# EasyEDA Pro project OpenEarable-PCB-main-2.0.epro, schematic OpenEarable - Main v2.7
Board Name: OpenEarable - Main v2.6; Create Date: 2025-05-28; Page Name: OpenEarable v2.7 Main - Schematic; Project Name: OpenEarable - Main v2.7; Schematic Name: OpenEarable - Main v2.7; Update Date: 2025-06-03; Add into BOM: yes; Company: Karlsruhe Institute of Technology; Convert to PCB: yes; Date: 2024-03-01; Draw By: OpenEarable Team; REV: 2.0; Sheet: 1/1
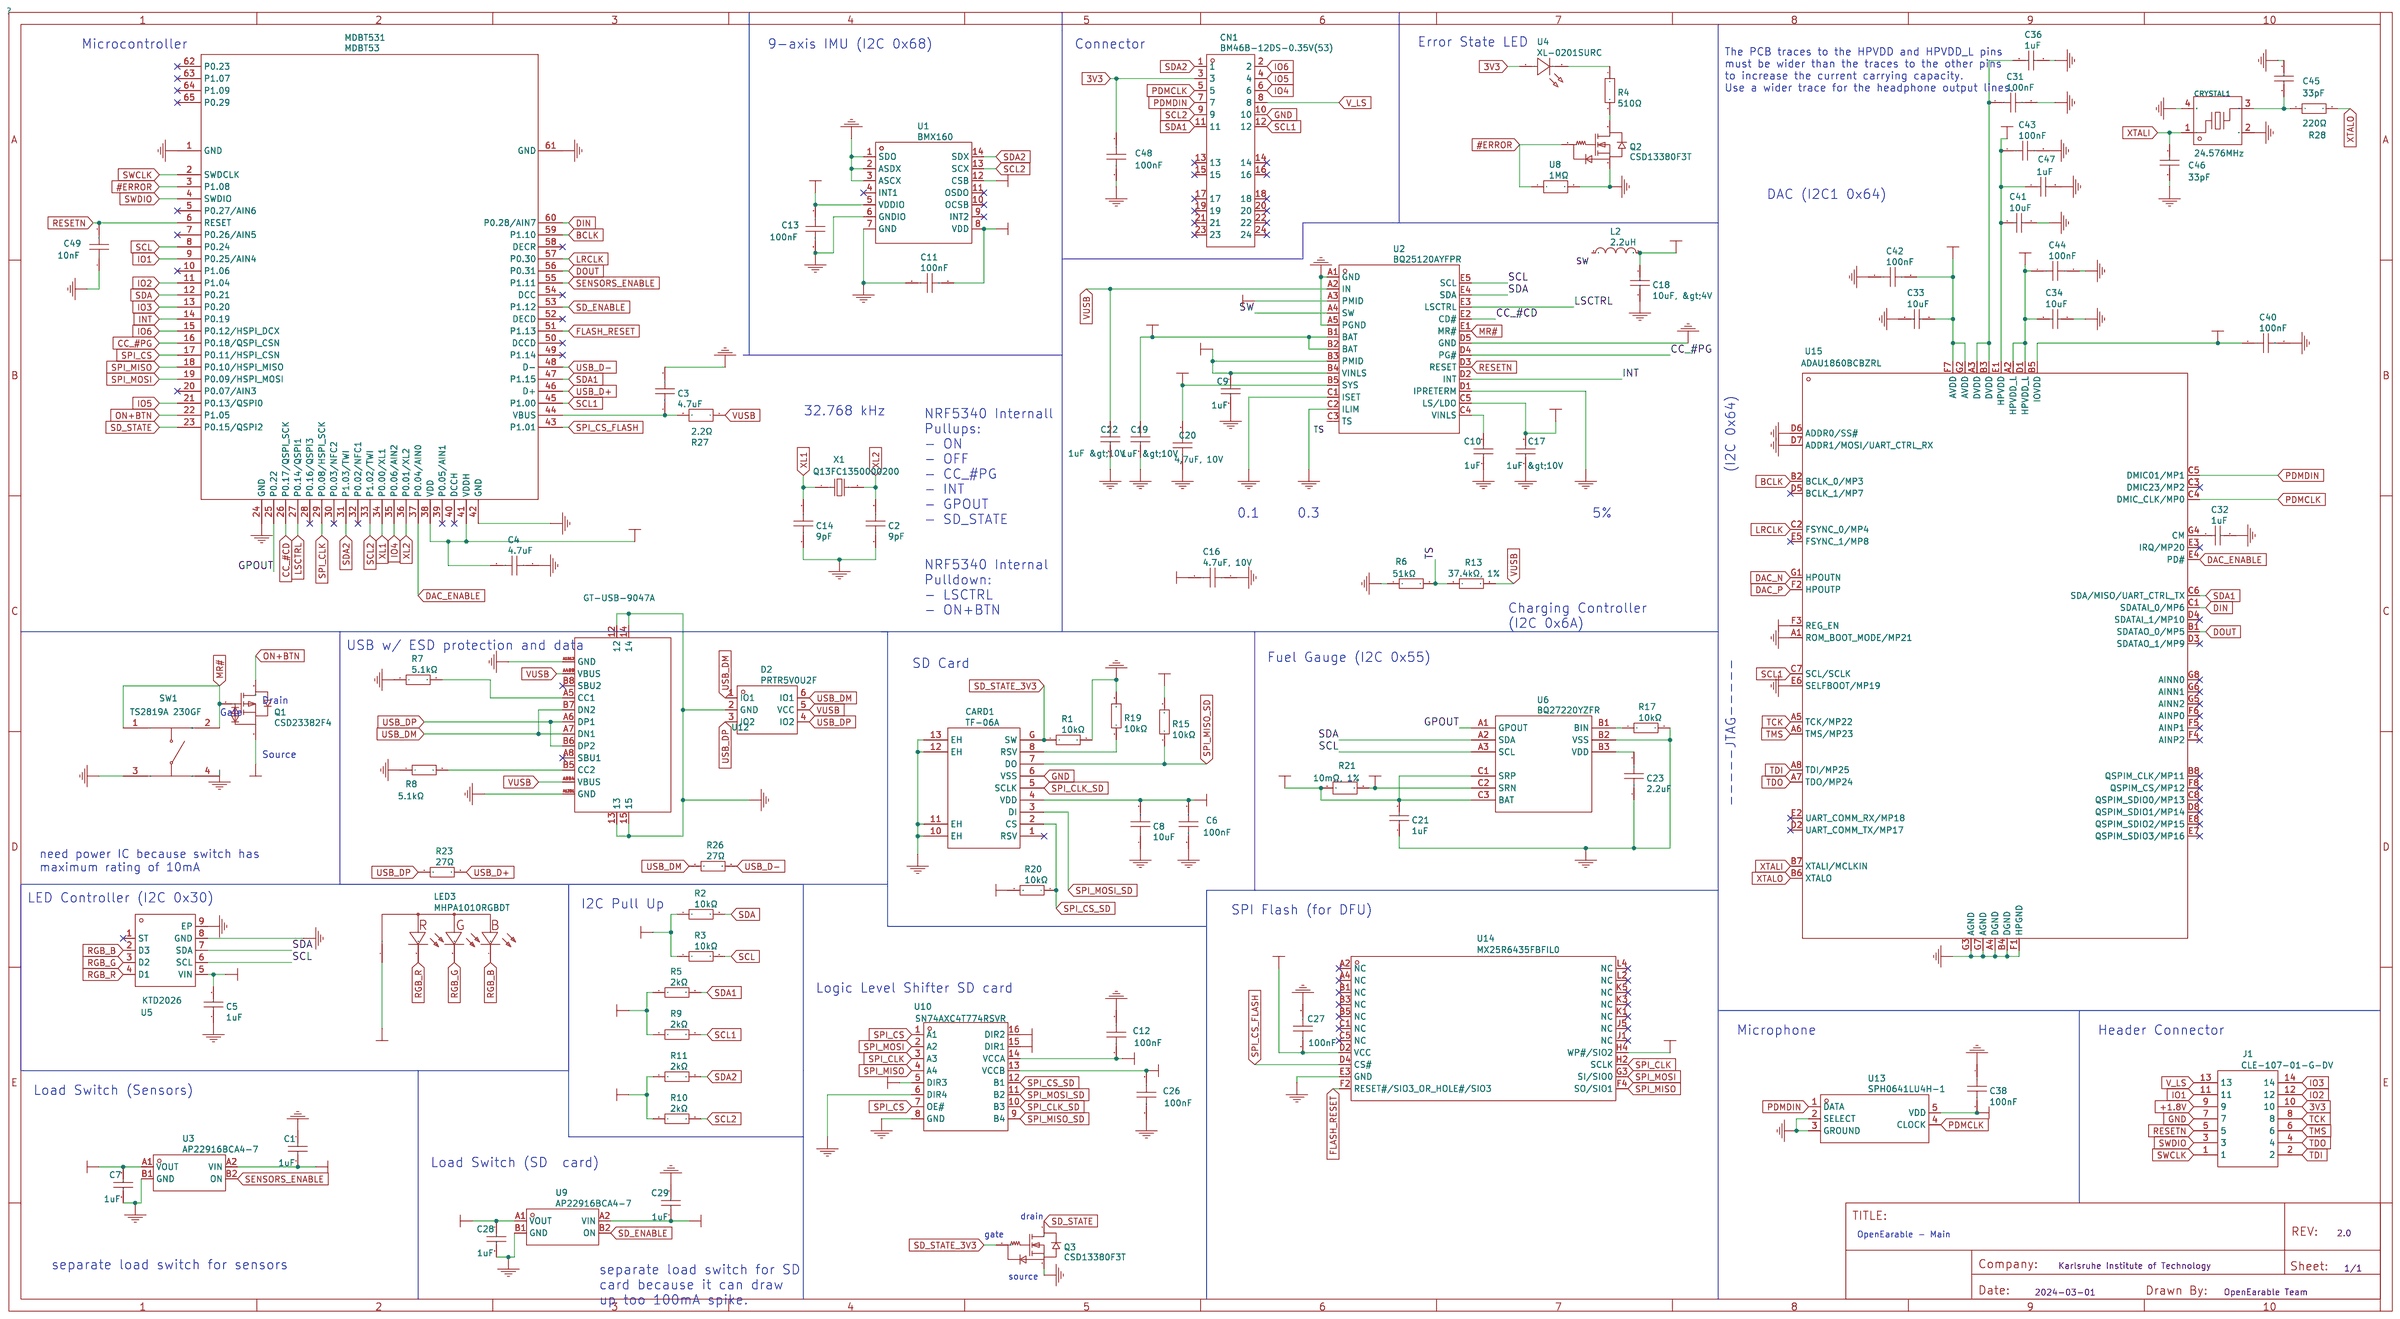
[diagram p0: schematic sheet]

## Parts
C1  1uF  [C0201]
C2  9pF  [C0201]
C3  4.7uF  [C0201]
C4  4.7uF  [C0201]
C5  1uF  [C0201]
C6  100nF  [C0201]
C7  1uF  [C0201]
C8  10uF  [C0402]
C9  1uF  [C0201]
C10  1uF  [C0201]
C11  100nF  [C0201]
C12  100nF  [C0201]
C13  100nF  [C0201]
C14  9pF  [C0201]
C16  4.7uF, 10V  [C0402]
C17  1uF &gt;10V  [C0201]
C18  10uF, &gt;4V  [C0402]
C19  1uF &gt;10V  [C0201]
C20  4.7uF, 10V  [C0402]
C21  1uF  [C0201]
C22  1uF &gt;10V  [C0201]
C23  2.2uF  [C0201]
C26  100nF  [C0201]
C27  100nF  [C0201]
C28  1uF  [C0201]
C29  1uF  [C0201]
C31  100nF  [C0201]
C32  1uF  [C0201]
C33  10uF  [C0402]
C34  10uF  [C0402]
C36  1uF  [C0201]
C38  100nF  [C0201]
C40  100nF  [C0201]
C41  10uF  [C0402]
C42  100nF  [C0201]
C43  100nF  [C0201]
C44  100nF  [C0201]
C45  33pF  [C0201]
C46  33pF  [C0201]
C47  1uF  [C0201]
C48  100nF  [C0201]
C49  10nF  [C0402]
CARD1  TF-06A  [TF-SMD_TF-06A]
CN1  BM46B-12DS-0.35V(53)  [FPC-SMD_12P-P0.35_BM46B-12DS-0.35V]
CRYSTAL1  24.576MHz  [CRYSTAL-SMD_4P-L2.0-W1.6-BL_HUAXIN_CN4]
D2  PRTR5V0U2F  [SON-6_L1.5-W1.0-P0.50-BL]
J1  CLE-107-01-G-DV  [CLE-107-01-X-DV]
L2  2.2uH  [L0402]
LED3  MHPA1010RGBDT  [LED-ARRAY-SMD_4P-L1.0-W1.0-TR-RD]
MDBT531  MDBT53  [MDBT53]
Q1  CSD23382F4  [PICOSTAR-3_L1.0-W0.6-P0.35-TL]
Q2  CSD13380F3T  [PICOSTAR-3_L0.7-W0.6-P0.40-TL]
Q3  CSD13380F3T  [PICOSTAR-3_L0.7-W0.6-P0.40-TL]
R1  10kΩ  [R0201]
R2  10kΩ  [R0201]
R3  10kΩ  [R0201]
R4  510Ω  [R0201]
R5  2kΩ  [R0201]
R6  51kΩ  [R0201]
R7  5.1kΩ  [R0201]
R8  5.1kΩ  [R0201]
R9  2kΩ  [R0201]
R10  2kΩ  [R0201]
R11  2kΩ  [R0201]
R13  37.4kΩ, 1%  [R0402]
R15  10kΩ  [R0201]
R17  10kΩ  [R0201]
R19  10kΩ  [R0201]
R20  10kΩ  [R0201]
R21  10mΩ, 1%  [R0402]
R23  27Ω  [R0201]
R26  27Ω  [R0201]
R27  2.2Ω  [R0201]
R28  220Ω  [R0201]
SW1  TS2819A 230GF  [SW-SMD_4P-L2.8-W1.9-P1.16-LS3.0]
U1  BMX160  [LGA-14_L3.0-W2.5-P0.50-BL]
U2  BQ25120AYFPR  [DSBGA-25_L2.5-W2.6-R5-C5-P0.40-BL]
U3  AP22916BCA4-7  [X1-WLB0808-4_L0.8-W0.8-P0.40-TL]
U4  XL-0201SURC  [LED-SMD_L0.65-W0.35-P0.41_XL-0201SURC]
U5  KTD2026  [DFN-8_L1.5-W1.5-P0.40-BL-EP]
U6  BQ27220YZFR  [DSBGA-9_L1.7-W1.6-R3-C3-P0.50-BL]
U8  1MΩ  [R0201]
U9  AP22916BCA4-7  [X1-WLB0808-4_L0.8-W0.8-P0.40-TL]
U10  SN74AXC4T774RSVR  [UQFN-16_L2.6-W1.8-P0.40-BL]
U12  GT-USB-9047A  [USB-C-SMD_GT-USB-9047A]
U13  SPH0641LU4H-1  [MIC-SMD_5P_L3.5-W2.7-P0.82_SPH0641LU4H-1]
U14  MX25R6435FBFIL0  [WLCSP-22_MX25R6435FBFIL0]
U15  ADAU1860BCBZRL  [BGA-56_L3.0-W2.7-P0.35-R8-C7-TL]
X1  Q13FC1350000200  [FC-135R_L3.2-W1.5]

## Library data of the parts
C1 C5 C7 C9 C10 C21 C28 C29 = 1uF: Supplier: LCSC; Manufacturer Part: GRM033R61A105ME44D; Manufacturer: muRata(村田); Supplier Part: C76935; JLCPCB Part Class: Extended Part
C2 C14 = 9pF: Supplier: LCSC; Supplier Part: C277498; Manufacturer: YAGEO(国巨); Manufacturer Part: CC0201CRNPO9BN9R0; JLCPCB Part Class: Extended Part; link: https://lcsc.com/eda_search?q=C277498&amp;%26type=1&amp;ref=editor
C3 C4 = 4.7uF: Supplier: LCSC; Supplier Part: C335103; Manufacturer: muRata(村田); Manufacturer Part: GRM035R60J475ME15D; JLCPCB Part Class: Extended Part; link: https://lcsc.com/eda_search?q=C335103&amp;%26type=1&amp;ref=editor
C6 C11-C13 C26 C27 = 100nF: Supplier: LCSC; Supplier Part: C2903664; Manufacturer: CCTC(三环); Manufacturer Part: TCC0201X5R104M6R3ZT; JLCPCB Part Class: Extended Part; link: https://lcsc.com/eda_search?q=C2903664&amp;%26type=1&amp;ref=editor
C8 = 10uF: Supplier: LCSC; Supplier Part: C2846677; Manufacturer: FH(风华); Manufacturer Part: 0402X106M100NT; JLCPCB Part Class: Extended Part
C16 C20 = 4.7uF, 10V: Supplier: LCSC; Supplier Part: C368809; Manufacturer: SAMSUNG(三星); Manufacturer Part: CL05A475KP5NRNC; JLCPCB Part Class: Extended Part
C17 C19 C22 = 1uF >10V: Supplier: LCSC; Manufacturer Part: GRM033R61A105ME44D; Manufacturer: muRata(村田); Supplier Part: C76935; JLCPCB Part Class: Extended Part
C18 = 10uF, >4V: Supplier: LCSC; Manufacturer Part: CL05A106MQ5NUNC; Manufacturer: SAMSUNG(三星); Supplier Part: C15525; JLCPCB Part Class: Basic Part
C23 = 2.2uF: Supplier: LCSC; Supplier Part: C285111; Manufacturer: FH(风华); Manufacturer Part: 0201X225M6R3NT; JLCPCB Part Class: Extended Part
C31 C38 C40 C42-C44 C48 = 100nF: Supplier: LCSC; Supplier Part: C76928; Manufacturer: muRata(村田); Manufacturer Part: GRM033R60J104KE19D; JLCPCB Part Class: Extended Part; link: https://lcsc.com/eda_search?q=C2903664&%26type=1&ref=editor
C32 C36 C47 = 1uF: Supplier: LCSC; Manufacturer Part: GRM033R60J105KEA2D; Manufacturer: muRata(村田); Supplier Part: C76929; JLCPCB Part Class: Extended Part
C33 C34 C41 = 10uF: Supplier: LCSC; Manufacturer Part: CL05A106MQ5NUNC; Manufacturer: SAMSUNG(三星); Supplier Part: C15525; JLCPCB Part Class: Basic Part
C45 C46 = GRM0335C1H330JA01D: Capacitance: Tolerance:±5% Tolerance:±5% Voltage Rated: Temperature Coefficient:; LCSC Part Name: 33pF ±5% 50V; Supplier Part: C76925; Manufacturer: muRata(村田); Supplier Footprint: 0201; JLCPCB Part Class: Extended Part; Datasheet: https://atta.szlcsc.com/upload/public/pdf/source/20180307/C76925_15204090911841407715.pdf; Supplier: LCSC; Tolerance: ±5%
C49 = C0402C103J3RACAUTO: Capacitance:10nF Tolerance:±5% Tolerance:±5% Voltage Rating:25V Temperature Coefficient:X7R; LCSC Part Name: 10nF ±5% 25V; Supplier Part: C2180806; Manufacturer: KEMET(基美); Supplier Footprint: 0402; JLCPCB Part Class: Extended Part; Datasheet: https://atta.szlcsc.com/upload/public/pdf/source/20210401/FDDC6E55C3E4F3789C68062DB1227DE4.pdf; Supplier: LCSC; Tolerance: ±5%; Voltage Rating: 25V; Temperature Coefficient: X7R
CARD1 = TF-06A: Supplier: LCSC; Supplier Part: C693844; Manufacturer: 韩国韩荣; JLCPCB Part Class: Extended Part
CN1 = BM46B-12DS-0.35V(51): Supplier: LCSC; Supplier Part: C3646713; Manufacturer: HRS(广濑); JLCPCB Part Class: Extended Part
CRYSTAL1 = CN4024M57620001: Crystal Type:贴片晶振 Frequency: Normal temperature Frequency Tolerance:±10ppm Normal temperature Frequency Tolerance:±10ppm External load capacitor:20pF Frequency Stability(Full temperature range):±30ppm Frequency Stability(Full temperature range):±30ppm Equ; LCSC Part Name: 24.576MHz ±10ppm 20pF; Supplier Part: C7294677; Manufacturer: HUAXIN(华昕); Supplier Footprint: SMD-2016-4P; JLCPCB Part Class: Extended Part; Datasheet: https://atta.szlcsc.com/upload/public/pdf/source/20230629/60BB1F001F1BE929A0AB11A98926D18A.pdf; Supplier: LCSC; Crystal Type: 贴片晶振; Normal temperature Frequency Tolerance: ±10ppm; External load capacitor: 20pF; Frequency Stability(Full temperature range): ±30ppm; Equivalent Series Resistance (ESR): 60Ω
D2 = PRTR5V0U2F: Supplier: LCSC; Supplier Part: C2937001; Manufacturer: TECH PUBLIC(台舟); JLCPCB Part Class: Extended Part
J1 = CLE-107-01-G-DV
L2 = 2.2uH: Supplier: LCSC; Supplier Part: C383389; Manufacturer: TDK; Manufacturer Part: MLZ1005M2R2WT000; JLCPCB Part Class: Extended Part
LED3 = MHPA1010RGBDT: Supplier: LCSC; Supplier Part: C404280; Manufacturer: MEIHUA(美华); JLCPCB Part Class: Extended Part
MDBT531 = MDBT53
Q1 = CSD23382F4: Supplier: LCSC; Supplier Part: C2861620; Manufacturer: TI(德州仪器); JLCPCB Part Class: Extended Part
Q2 Q3 = CSD13380F3T: Supplier: LCSC; Supplier Part: C2871092; Manufacturer: TI(德州仪器); JLCPCB Part Class: Extended Part
R1-R3 R15 R17 R19 R20 = 10kΩ: Supplier: LCSC; Manufacturer: YAGEO(国巨); Manufacturer Part: RC0201FR-0710KL; Supplier Part: C106225; JLCPCB Part Class: Extended Part
R4 = 510Ω: Supplier: LCSC; Supplier Part: C180335; Manufacturer: Walsin(华新科); Manufacturer Part: WR02X511JAL; JLCPCB Part Class: Extended Part
R5 R9-R11 = 2kΩ: Supplier: LCSC; Supplier Part: C100158; Manufacturer: LIZ(丽智电子); Manufacturer Part: CR0201JH0202G; JLCPCB Part Class: Extended Part
R6 = 51kΩ: Supplier: LCSC; Supplier Part: C320938; Manufacturer: FH(风华); Manufacturer Part: RC-01W5102FT; JLCPCB Part Class: Extended Part
R7 R8 = 5.1kΩ: Supplier: LCSC; Supplier Part: C274341; Manufacturer: YAGEO(国巨); Manufacturer Part: RC0201FR-075K1L; JLCPCB Part Class: Extended Part
R13 = 37.4kΩ, 1%: Supplier: LCSC; Supplier Part: C185422; Manufacturer: YAGEO(国巨); Manufacturer Part: RC0402FR-0737K4L; JLCPCB Part Class: Extended Part
R21 = 10mΩ, 1%: Supplier: LCSC; Supplier Part: C346478; Manufacturer: SEI(Stackpole Electronics Inc.); Manufacturer Part: CSRF0402FT10L0; JLCPCB Part Class: Extended Part
R23 R26 = 27Ω: Supplier: LCSC; Supplier Part: C273268; Manufacturer: YAGEO(国巨); Manufacturer Part: RC0201FR-0727RL; JLCPCB Part Class: Extended Part
R27 = 2.2Ω: Supplier: LCSC; Supplier Part: C473517; Manufacturer: UNI-ROYAL(厚声); Manufacturer Part: 0201WMF220KTEE; JLCPCB Part Class: Extended Part
R28 = RC0201FR-07220RL: Type:Thick Film Resistors Resistance: Tolerance:±1% Tolerance:±1% Power(Watts): Overload Voltage (Max): Temperature Coefficient:±200ppm/℃ Temperature Coefficient:±200ppm/℃ Operating Temperature Range:-55℃~+125℃ Operating Temperature Range:-55℃~+125℃; LCSC Part Name: 厚膜电阻 220Ω ±1% 50mW; Supplier Part: C274342; Manufacturer: YAGEO(国巨); Supplier Footprint: 0201; JLCPCB Part Class: Extended Part; Datasheet: https://atta.szlcsc.com/upload/public/pdf/source/20180821/C275644_0D56F95EFF785E7D9A1FEF436B37DA78.pdf; Supplier: LCSC; Type: Thick Film Resistors; Tolerance: ±1%; Temperature Coefficient: ±200ppm/℃; Operating Temperature Range: -55℃~+125℃
SW1 = TS2819A 230GF: Supplier: LCSC; Supplier Part: C388293; Manufacturer: SHOU HAN(首韩); Manufacturer Part: TS2819A 230gf; JLCPCB Part Class: Extended Part
U1 = BMX160: Supplier Part: 828-1087-1-ND; Supplier: Digi-Key; Manufacturer: Bosch; Manufacturer Part: BMI160
U2 = BQ25120AYFPR: Supplier: LCSC; Supplier Part: C2866577; Manufacturer: TI(德州仪器); JLCPCB Part Class: Extended Part; link: https://lcsc.com/eda_search?q=C2866577&amp;%26type=1&amp;ref=editor
U3 U9 = AP22916BCA4-7: Supplier: LCSC; Supplier Part: C5244375; Manufacturer: DIODES(美台); JLCPCB Part Class: Extended Part
U4 = XL-0201SURC: Supplier: LCSC; Supplier Part: C3646923; Manufacturer: XINGLIGHT(成兴光); JLCPCB Part Class: Extended Part
U5 = KTD2026: Supplier: LCSC; Supplier Part: C500368; Manufacturer: KINETIC(芯凯); Manufacturer Part: KTD2026EWE-TR; JLCPCB Part Class: Extended Part
U6 = BQ27220YZFR: Supplier: LCSC; Supplier Part: C528617; Manufacturer: TI(德州仪器); JLCPCB Part Class: Extended Part; link: https://lcsc.com/eda_search?q=C528617&amp;%26type=1&amp;ref=editor
U8 = 1MΩ: Supplier: LCSC; Supplier Part: C5151554; Manufacturer: UNI-ROYAL(厚声); Manufacturer Part: CQ01WMJ0105TEE; JLCPCB Part Class: Extended Part
U10 = SN74AXC4T774RSVR: Supplier: LCSC; Supplier Part: C1849454; Manufacturer: TI(德州仪器); JLCPCB Part Class: Extended Part
U12 = GT-USB-9047A: Supplier: LCSC; Supplier Part: C5117882; Manufacturer: G-Switch(品赞); JLCPCB Part Class: Extended Part
U13 = SPH0641LU4H-1: Supplier: LCSC; Supplier Part: C2879853; Manufacturer: Knowles(楼氏); JLCPCB Part Class: Extended Part
U14 = MX25R6435FBFIL0: Supplier: LCSC; Supplier Part: C6330263; Manufacturer: MXIC(旺宏电子); JLCPCB Part Class: Extended Part
U15 = ADAU1860BCBZRL: Supplier: LCSC; Supplier Part: C17592940; Manufacturer: ADI(亚德诺); JLCPCB Part Class: Extended Part
X1 = Q13FC1350000200: Supplier: LCSC; Manufacturer: EPSON(爱普生); Supplier Part: C48615; JLCPCB Part Class: Extended Part

## Nets
3V3: C5.2 C17.1 C29.2 C48.1 CN1.3 J1.10 LED3.1(+) U2.C5(LS/LDO) U4.1(A) U5.5(VIN) U9.A2(VIN)
+1.8V: C1.2 C4.2 C18.1 C20.2 J1.9 L2.2 MDBT531.38(VDD) MDBT531.41(VDDH) Q1.2(S) R2.1 R3.1 U2.B5(SYS) U3.A2(VIN)
GND: C1.1 C2.1 C3.2 C4.1 C5.1 C6.2 C7.2 C8.1 C9.2 C10.2 C11.1 C12.1 C13.2 C14.1 C16.1 C17.2 C18.2 C19.2 C20.1 C21.1 C22.2 C23.1 C26.2 C27.1 C28.2 C29.1 C31.2 C32.2 C33.1 C34.2 C36.2 C38.1 C40.2 C41.2 C42.1 C43.2 C44.2 C45.2 C46.1 C47.2 C48.2 C49.1 CARD1.6(VSS) CARD1.10(EH) CARD1.11(EH) CARD1.12(EH) CARD1.13(EH) CN1.10 CRYSTAL1.2(GND) CRYSTAL1.4(GND) D2.2(GND) J1.7 MDBT531.1(GND) MDBT531.24(GND) MDBT531.42(GND) MDBT531.61(GND) Q2.2(S) Q3.2(S) R1.2 R6.1 R7.1 R8.1 R17.2 R19.2 SW1.3(B) SW1.4(B&apos;) U1.1(SDO) U1.2(ASDX) U1.3(ASCX) U1.6(GNDIO) U1.7(GND) U2.A1(GND) U2.A5(PGND) U2.C1(ISET) U2.C2(ILIM) U2.D1(IPRETERM) U2.D5(GND) U3.B1(GND) U5.8(GND) U5.9(EP) U6.B2(VSS) U8.2 U9.B1(GND) U10.6(DIR4) U10.8(GND) U12.12 U12.13 U12.14 U12.15 U12.A1B12(GND) U12.A12B1(GND) U13.2(SELECT) U13.3(GROUND) U14.E3(GND) U15.A1(ROM_BOOT_MODE/MP21) U15.A4(DGND) U15.B4(DGND) U15.D6(ADDR0/SS#) U15.D7(ADDR1/MOSI/UART_CTRL_RX) U15.E6(SELFBOOT/MP19) U15.F1(HPGND) U15.G3(AGND) U15.G7(AGND)
VCC: C19.1 R21.2 U2.B1(BAT) U2.B2(BAT) U6.C2(SRN)
#ERROR: MDBT531.3(P1.08) Q2.1(G) U8.1
BCLK: MDBT531.59(P1.10) U15.B2(BCLK_0/MP3)
CC_#CD: MDBT531.26(P0.17/QSPI_SCK) U2.E2(CD#)
CC_#PG: MDBT531.16(P0.18/QSPI_CSN) U2.D4(PG#)
DAC_ENABLE: MDBT531.37(P0.04/AIN0) U15.E4(PD#)
DAC_N: U15.G1(HPOUTN)
DAC_P: U15.F2(HPOUTP)
DIN: MDBT531.60(P0.28/AIN7) U15.C1(SDATAI_0/MP6)
DOUT: MDBT531.56(P0.31) U15.B1(SDATAO_0/MP5)
FLASH_RESET: MDBT531.51(P1.13) U14.F2(RESET#/SIO3 OR HOLE#/SIO3)
GPOUT: MDBT531.25(P0.22) U6.A1(GPOUT)
INT: MDBT531.14(P0.19) U2.D2(INT)
IO1: J1.11 MDBT531.9(P0.25/AIN4)
IO2: J1.12 MDBT531.11(P1.04)
IO3: J1.14 MDBT531.13(P0.20)
IO4: CN1.6 MDBT531.35(P0.06/AIN2)
IO5: CN1.4 MDBT531.21(P0.13/QSPI0)
IO6: CN1.2 MDBT531.15(P0.12/HSPI_DCX)
LRCLK: MDBT531.57(P0.30) U15.C2(FSYNC_0/MP4)
LSCTRL: MDBT531.27(P0.14/QSPI1) U2.E3(LSCTRL)
MR#: Q1.1(G) SW1.1(A) SW1.2(A&apos;) U2.E1(MR#)
ON+BTN: MDBT531.22(P1.05) Q1.3(D)
PDMCLK: CN1.5 U13.4(CLOCK) U15.C4(DMIC_CLK/MP0)
PDMDIN: CN1.7 U13.1(DATA) U15.C5(DMIC01/MP1)
RESETN: C49.2 J1.5 MDBT531.6(RESET) U2.D3(RESET)
RGB_B: LED3.4(B-) U5.2(D3)
RGB_G: LED3.3(G-) U5.3(D2)
RGB_R: LED3.2(R-) U5.4(D1)
SCL: MDBT531.8(P0.24) R3.2 U2.E5(SCL) U5.6(SCL) U6.A3(SCL)
SCL1: CN1.12 MDBT531.45(P1.00) R9.2 U15.C7(SCL/SCLK)
SCL2: CN1.9 MDBT531.33(P1.02/TWI) R10.2 U1.13(SCX)
SD_ENABLE: MDBT531.53(P1.12) U9.B2(ON)
SD_STATE: MDBT531.23(P0.15/QSPI2) Q3.3(D)
SD_STATE_3V3: CARD1.G(SW) Q3.1(G) R1.1
SDA: MDBT531.12(P0.21) R2.2 U2.E4(SDA) U5.7(SDA) U6.A2(SDA)
SDA1: CN1.11 MDBT531.47(P1.15) R5.2 U15.C6(SDA/MISO/UART_CTRL_TX)
SDA2: CN1.1 MDBT531.31(P1.03/TWI) R11.2 U1.14(SDX)
SENSORS_ENABLE: MDBT531.55(P1.11) U3.B2(ON)
SPI_CLK: MDBT531.29(P0.08/HSPI_SCK) U10.3(A3) U14.H2(SCLK)
SPI_CLK_SD: CARD1.5(SCLK) U10.10(B3)
SPI_CS: MDBT531.17(P0.11/HSPI_CSN) U10.1(A1) U10.7(OE#)
SPI_CS_FLASH: MDBT531.43(P1.01) U14.D4(CS#)
SPI_CS_SD: CARD1.2(CS) R20.1 U10.12(B1)
SPI_MISO: MDBT531.18(P0.10/HSPI_MISO) U10.4(A4) U14.F4(SO/SIO1)
SPI_MISO_SD: CARD1.7(DO) R15.1 U10.9(B4)
SPI_MOSI: MDBT531.19(P0.09/HSPI_MOSI) U10.2(A2) U14.G3(SI/SIO0)
SPI_MOSI_SD: CARD1.3(DI) U10.11(B2)
SW: L2.1 U2.A4(SW)
SWCLK: J1.1 MDBT531.2(SWDCLK)
SWDIO: J1.3 MDBT531.4(SWDIO)
TCK: J1.8 U15.A5(TCK/MP22)
TDI: J1.2 U15.A8(TDI/MP25)
TDO: J1.4 U15.A7(TDO/MP24)
TMS: J1.6 U15.A6(TMS/MP23)
TS: R6.2 R13.1 U2.C3(TS)
USB_D+: MDBT531.46(D+) R23.2
USB_D-: MDBT531.48(D-) R26.2
USB_DM: D2.1(IO1) D2.6(IO1) R26.1 U12.A7(DN1) U12.B7(DN2)
USB_DP: D2.3(IO2) D2.4(IO2) R23.1 U12.A6(DP1) U12.B6(DP2)
V_BAT: C21.2 R21.1 U6.C1(SRP) U6.C3(BAT)
V_LS: C7.1 C11.2 C12.2 C13.1 C27.2 C33.2 C34.1 C38.2 C40.1 C41.1 C42.2 C43.1 C44.1 C47.1 CN1.8 J1.13 R5.1 R9.1 R10.1 R11.1 U1.5(VDDIO) U1.8(VDD) U1.12(CSB) U3.A1(VOUT) U10.5(DIR3) U10.14(VCCA) U10.15(DIR1) U10.16(DIR2) U13.5(VDD) U14.D2(VCC) U14.H4(WP#/SIO2) U15.A2(HPVDD_L) U15.B5(IOVDD) U15.D1(HPVDD_L) U15.E1(HPVDD) U15.F3(REG_EN) U15.F7(AVDD) U15.G2(AVDD)
V_PMID: C9.1 C16.2 U2.A3(PMID) U2.B3(PMID) U2.B4(VINLS)
V_SD: C6.1 C8.2 C26.1 C28.1 CARD1.4(VDD) R15.2 R20.2 U9.A1(VOUT) U10.13(VCCB)
VUSB: C22.1 D2.5(VCC) R13.2 R27.1 U2.A2(IN) U12.A4B9(VBUS) U12.A9B4(VBUS)
XL1: C14.2 MDBT531.34(P0.00/XL1) X1.1
XL2: C2.2 MDBT531.36(P0.01/XL2) X1.2
XTALI: C46.2 CRYSTAL1.1 U15.B7(XTALI/MCLKIN)
XTALO: R28.2 U15.B6(XTALO)
$1N36: CARD1.8(RSV) R19.1
$1N48: R7.2 U12.A5(CC1)
$1N49: R8.2 U12.B5(CC2)
$1N65: C10.1 U2.C4(VINLS)
$1N70: C23.2 U6.B3(VDD)
$1N74: R17.1 U6.B1(BIN)
$1N98: C3.1 MDBT531.44(VBUS) R27.2
$1N117: Q2.3(D) R4.2
$1N119: R4.1 U4.2(K)
$1N151: C31.1 C36.1 U15.A3(DVDD) U15.B3(DVDD)
$1N2586: C32.1 U15.G4(CM)
$1N16368: C45.1 CRYSTAL1.3 R28.1

Not connected (* = marked no-connect by the designer): CARD1 1(RSV)*; CN1 13* 14* 15* 16* 17* 18* 19* 20* 21* 22* 23* 24*; MDBT531 5(P0.27/AIN6)* 7(P0.26/AIN5)* 10(P1.06)* 20(P0.07/AIN3)* 28(P0.16/QSPI3)* 30(P0.03/NFC2)* 32(P0.02/NFC1)* 39(P0.05/AIN1)* 40(DCCH)* 49(P1.14)* 50(DCCD)* 52(DECD)* 54(DCC)* 58(DECR)* 62(P0.23)* 63(P1.07)* 64(P1.09)* 65(P0.29)*; U1 4(INT1)* 9(INT2)* 10(OCSB)* 11(OSDO)*; U5 1(ST)*; U12 A8(SBU1)* B8(SBU2)*; U14 A2(NC)* A4(NC)* B1(NC)* B3(NC)* B5(NC)* C1(NC)* C5(NC)* J1(NC)* J5(NC)* K1(NC)* K3(NC)* K5(NC)* L2(NC)* L4(NC)*; U15 B8(QSPIM_CLK/MP11)* C3(DMIC23/MP2)* C8(QSPIM_SDIO0/MP13)* D2(UART_COMM_TX/MP17)* D3(SDATAO_1/MP9)* D4(SDATAI_1/MP10)* D5(BCLK_1/MP7)* D8(QSPIM_SDIO1/MP14)* E2(UART_COMM_RX/MP18)* E3(IRQ/MP20)* E5(FSYNC_1/MP8)* E7(QSPIM_SDIO3/MP16)* E8(QSPIM_SDIO2/MP15)* F4(AINP2)* F5(AINP1)* F6(AINP0)* F8(QSPIM_CS/MP12)* G5(AINN2)* G6(AINN1)* G8(AINN0)*

## Notes on the sheet
- Microcontroller
- 9-axis IMU (I2C 0x68)
- Connector
- Error State LED
- The PCB traces to the HPVDD and HPVDD_L pins
  must be wider than the traces to the other pins
  to increase the current carrying capacity.
  Use a wider trace for the headphone output lines.
- DAC (I2C1 0x64)
- NRF5340 Internall
  Pullups:
  - ON
  - OFF
  - CC_#PG
  - INT
  - GPOUT
  - SD_STATE
  NRF5340 Internal
  Pulldown:
  - LSCTRL
  - ON+BTN
- 32.768 kHz
- (I2C 0x64)
- 0.1
- 0.3
- 5%
- Charging Controller
  (I2C 0x6A)
- USB w/ ESD protection and data
- SD Card
- Fuel Gauge (I2C 0x55)
- Drain
- Gate
- Source
- -----JTAG-----
- need power IC because switch has
  maximum rating of 10mA
- LED Controller (I2C 0x30)
- I2C Pull Up
- SPI Flash (for DFU)
- Logic Level Shifter SD card
- Microphone
- Header Connector
- Load Switch (Sensors)
- Load Switch (SD  card)
- drain
- gate
- OpenEarable - Main
- separate load switch for SD
  card because it can draw
  up too 100mA spike.
- separate load switch for sensors
- source
